# Altium schematic sheet Row.SchDoc: Segment Driver
size A4; Address1: Smoka Wawelskiego 1; Address2: 30-535 Kraków, Poland; DocumentNumber: 8; Revision: v01; SheetNumber: 8; SheetTotal: 9; Author: Miroslaw Folejewski; CompanyName: Mirko Electronics; DrawnBy: Miroslaw Folejewski; Engineer: Miroslaw Folejewski; PageSetup: Record=PageOptions|CenterHorizontal=True|CenterVertical=True|PrintScale=1.00|XCorrection=1.00|YCorrection=1.00|PrintKind=0|BorderSize=5000000|LeftOffset=0|BottomOffset=0|Orientation=2|PaperLength=1000|PaperWidth=1000|Scale=100|PaperSource=7|PrintQuality=-4|MediaType=1|DitherType=10|PaperKind=A4|PrintScaleMode=1; PageSize: A4; Designators: -; ProjectName: 7-Segment LED Matrix Display
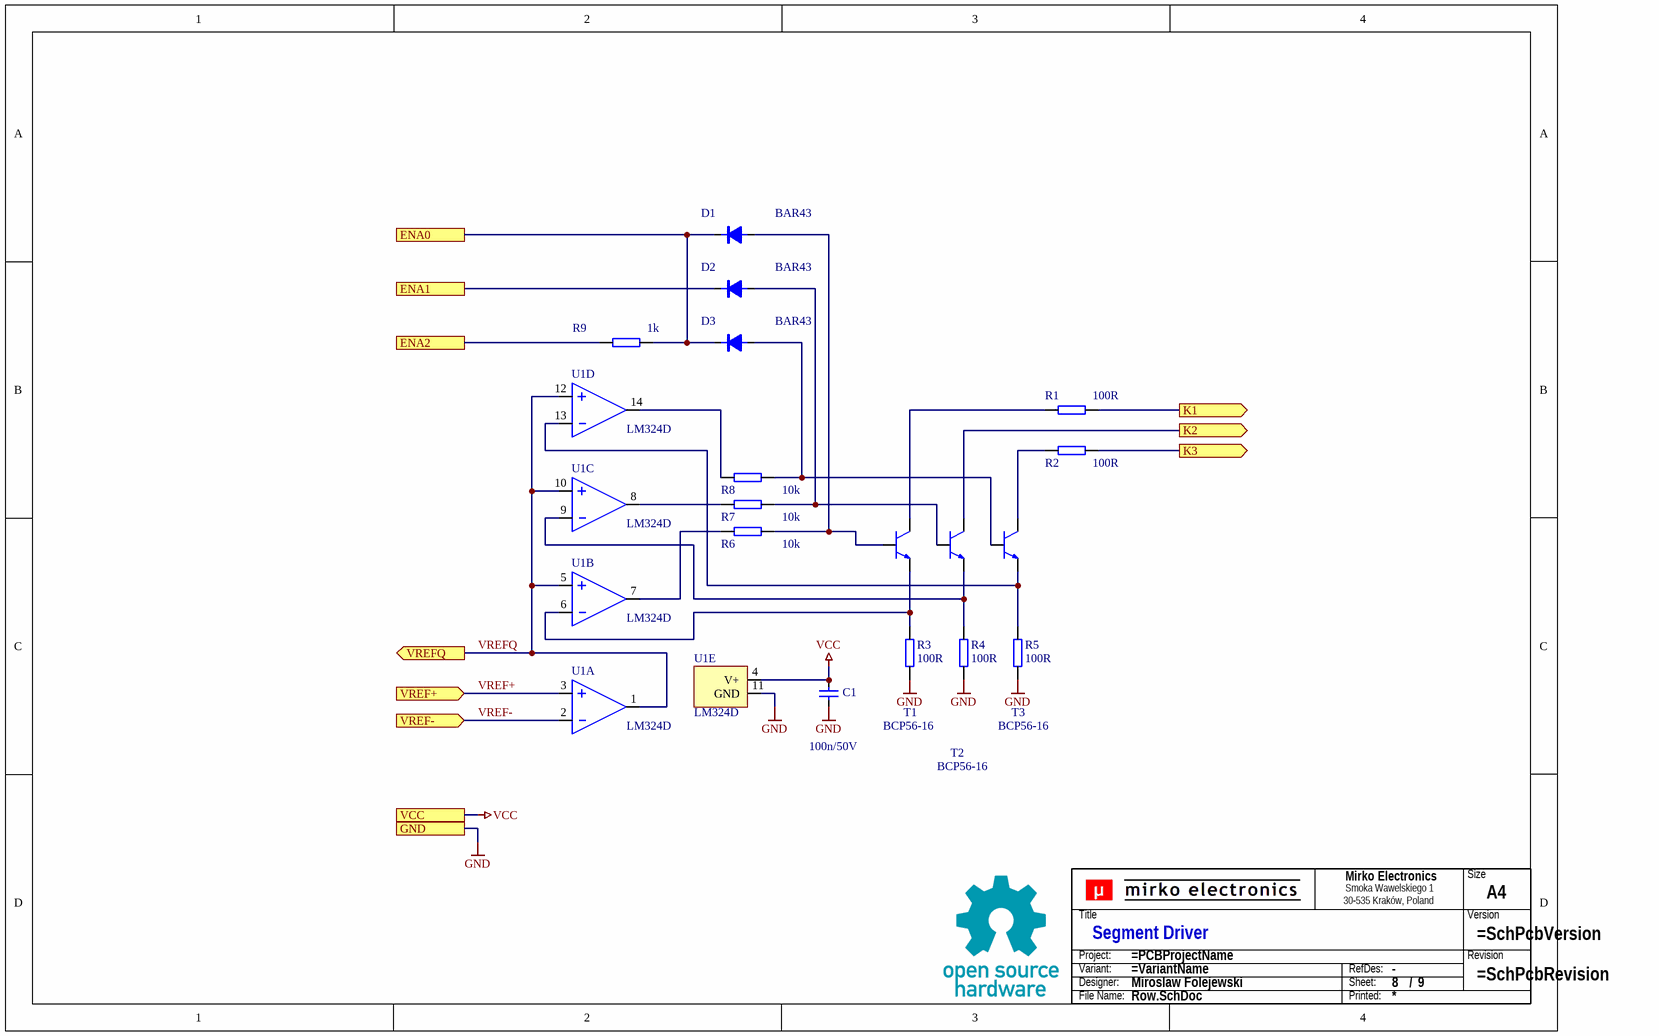
[diagram p0: Row.SchDoc]

## Parts
?  (no value)  (graphical)
C1  100n/50V  [0805]
D1  BAR43  [SOT-23]
D2  BAR43  [SOT-23]
D3  BAR43  [SOT-23]
R1  100R  [1206]
R2  100R  [1206]
R3  100R  [1206]
R4  100R  [1206]
R5  100R  [1206]
R6  10k  [0805]
R7  10k  [0805]
R8  10k  [0805]
R9  1k  [0805]
T1  BCP56-16  [SOT223]
T2  BCP56-16  [SOT223]
T3  BCP56-16  [SOT223]
TB?  Title block  (value not drawn)  (graphical)
U1  LM324D  [SO14]  (parts A,B,C,D,E of 5)

## Ports
ENA0, ENA1, ENA2, GND, K1 (out), K2 (out), K3 (out), VCC, VREF+ (in), VREF- (in), VREFQ (out)

## Nets
GND: C1.2 R3.2 R4.2 R5.2 U1.11(GND) ; port GND
VCC: C1.1 U1.4(V+) ; port VCC
ENA0: D1.3 D3.3 R9.2 ; port ENA0
ENA1: D2.3 ; port ENA1
ENA2: R9.1 ; port ENA2
K1: R1.2 ; port K1
K2: T2.2(C) ; port K2
K3: R2.2 ; port K3
VREF+: U1.3(+) ; port VREF+
VREF-: U1.2(-) ; port VREF-
VREFQ: U1.1(OUT) U1.5(+) U1.10(+) U1.12(+) ; port VREFQ
NetD1_1: D1.1 R6.2 T1.1(B)
NetD2_1: D2.1 R7.2 T2.1(B)
NetD3_1: D3.1 R8.2 T3.1(B)
NetR1_1: R1.1 T1.2(C)
NetR2_1: R2.1 T3.2(C)
NetR3_1: R3.1 T1.3(E) U1.6(-)
NetR4_1: R4.1 T2.3(E) U1.9(-)
NetR5_1: R5.1 T3.3(E) U1.13(-)
NetR6_1: R6.1 U1.7(OUT)
NetR7_1: R7.1 U1.8(OUT)
NetR8_1: R8.1 U1.14(OUT)

## Notes on the sheet
- Title
- Size
- Revision
- Checked By:
- Project:
- Variant:
- Engineer:
- Date:
- Sheet:
- /
- Designators
- Approved By:
- File:
- (in symbol SCH_TITLE_BLOCK_V1) Size; Title; Version; Project:; Revision; Variant:; RefDes:; Designer:; Sheet:; /; File Name:; Printed:

## Library data of the parts
? = Title Block NeoStrain
C1 = CAP
R1-R9 = R0805
TB? = SCH_TITLE_BLOCK_V1: Component Type: Title block; Manufacturer: -; Mounting Type: Non component; MPN: -; Operating Temperature: -; Package: -; Specification: Title block; Value: Title block; Replacement: -; System: ?